# Altium schematic sheet H-Bridge - DRV8829.SchDoc
size A
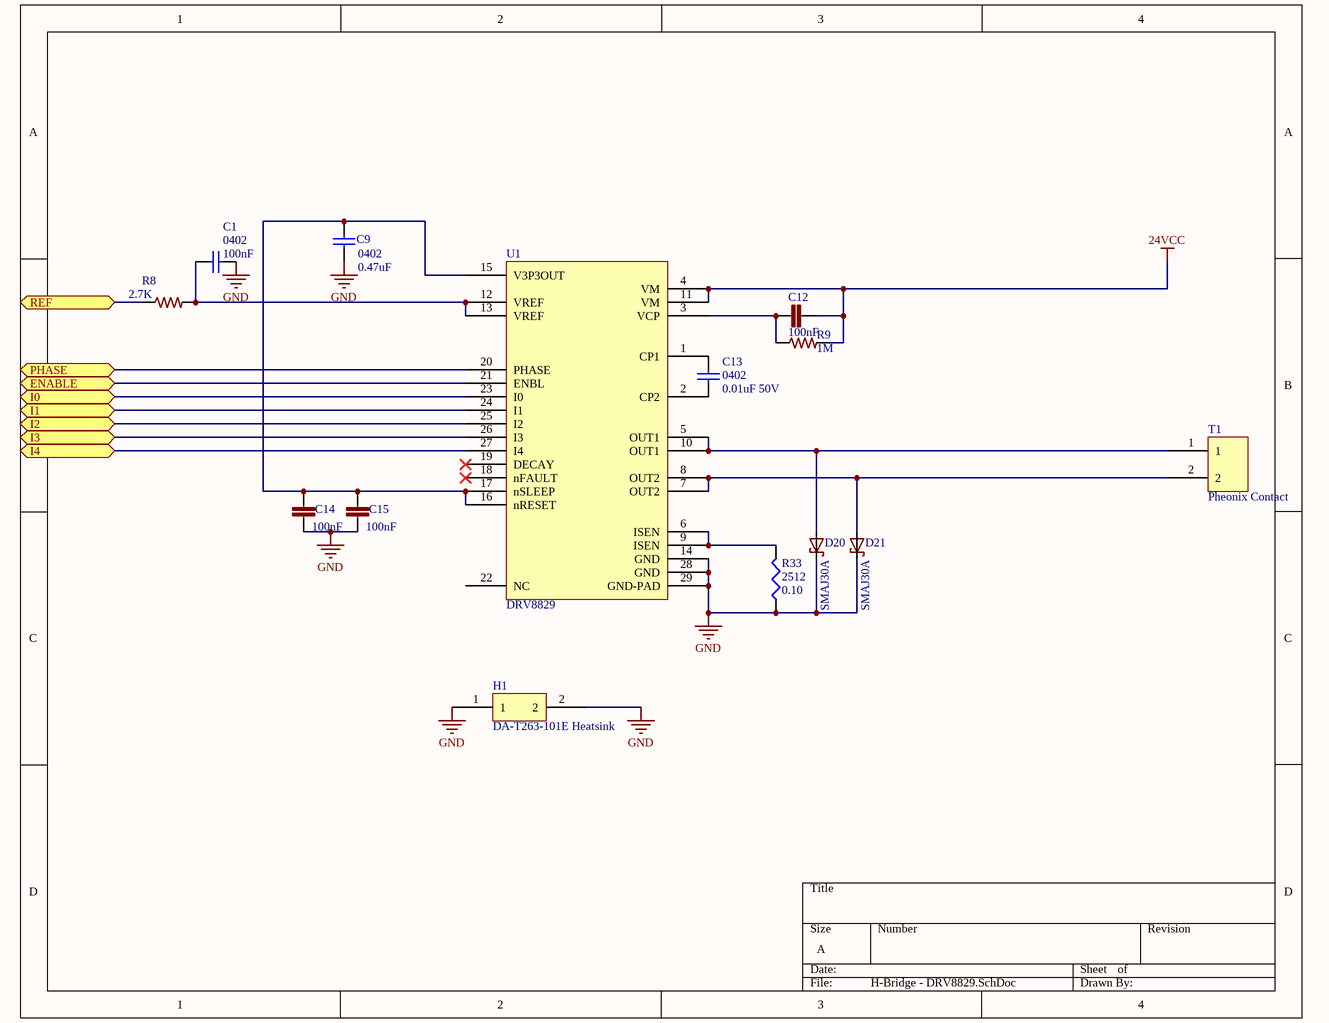
[diagram p0: H-Bridge - DRV8829.SchDoc]

## Parts
C1  value 100nF  [C0402]  (hidden comment: 0402)
C9  value 0.47uF  [C0402]  (hidden comment: 0402)
C12  100nF  [C0603]
C13  value 0.01uF 50V  [C0402]  (hidden comment: 0402)
C14  100nF  [C0402]
C15  100nF  [C0402]
D20  SMAJ30A  [SMA-SM]
D21  SMAJ30A  [SMA-SM]
H1  DA-T263-101E Heatsink  [DA-T263-101E]
R8  2.7K  [R0402]
R9  1M  [R0402]
R33  2512  value 0.10  [2512R-0.55]
T1  Pheonix Contact  [CON-PHEONIX-508-Alt]
U1  DRV8829  [TSSOP28-DRV8829]

## Ports
ENABLE, I0, I1, I2, I3, I4, PHASE, REF

## Nets
24VCC: C12.2 R9.2 U1.4(VM) U1.11(VM)
GND: C1.1 C9.1 C14.2 C15.2 D20.C D21.C H1.1 H1.2 R33.1 U1.14(GND) U1.28(GND) U1.29(GND-PAD)
ENABLE: U1.21(ENBL) ; port ENABLE
I0: U1.23(I0) ; port I0
I1: U1.24(I1) ; port I1
I2: U1.25(I2) ; port I2
I3: U1.26(I3) ; port I3
I4: U1.27(I4) ; port I4
PHASE: U1.20(PHASE) ; port PHASE
REF: R8.1 ; port REF
NetC1_2: C1.2 R8.2 U1.12(VREF) U1.13(VREF)
NetC9_2: C9.2 C14.1 C15.1 U1.15(V3P3OUT) U1.16(nRESET) U1.17(nSLEEP)
NetC12_1: C12.1 R9.1 U1.3(VCP)
NetC13_1: C13.1 U1.2(CP2)
NetC13_2: C13.2 U1.1(CP1)
NetD20_A: D20.A T1.1 U1.5(OUT1) U1.10(OUT1)
NetD21_A: D21.A T1.2 U1.7(OUT2) U1.8(OUT2)
NetR33_2: R33.2 U1.6(ISEN) U1.9(ISEN)

Not connected (* = marked no-connect by the designer): U1 18(nFAULT)* 19(DECAY)* 22(NC)

## Library data of the parts
C1 = 100nF C0402 - GRM155R71C104KA88D: Capacitor (Semiconductor SIM Model); MFR: Murata; Part Description: CAP CER 0.1UF 16V 10% X7R 0402; Tolerance: 10%; Voltage: 16v; Published: 10 - Dec - 2014; LatestRevisionDate: 10 - Dec - 2014; LatestRevisionNote: Ultimachine Footprint Added; Publisher: Ultimachine; Component Type: Chip Capacitor; MFR Part #: GRM155R71C104KA88D; Mounting Type: SMT 0402; Datasheet: http://psearch.murata.com/capacitor/product/GRM155R71C104KA88%23.pdf; Height: 0.5 ±0.05mm; PackageReference: 0402
C9 = GRM155R60J474KE19D: 0.47uF 6.3v C0402 - GRM155R60J474KE19D; MFR: Murata; Part Description: CAP CER 0.47UF 6.3V 10% X5R 0402; Tolerance: 10%; Voltage: 6.3VDC; Published: 10 - Dec - 2014; LatestRevisionDate: 10 - Dec - 2014; LatestRevisionNote: Ultimachine Footprint Added; Publisher: Ultimachine; Component Type: Chip Capacitor; MFR Part #: GRM155R60J474KE19D; Mounting Type: SMT 0402; Datasheet: http://search.murata.co.jp/Ceramy/image/img/A01X/G101/ENG/GRM155R60J474KE19-01.pdf; Height: 0.5 ±0.05mm; PackageReference: 0402
C12 = C0603C104K5RACTU: CAP CER 0603 100nF 50V 10% X7R; LastRevisionNote: ImportComponents; Published: 23-Apr-2014; Publisher: UltiMachine; LastRevisionDate: 23-Apr-2014; ManufacturerPartNumber: C0603C104K5RACTU; VALUE: 100nF
C13 = GRM155R71H103JA88D: CAP CER 10000PF 50V X7R 0402; MFR: Murata; Tolerance: 10%; Voltage: 6.3VDC; Published: 10 - Dec - 2014; LatestRevisionDate: 10 - Dec - 2014; LatestRevisionNote: Ultimachine Footprint Added; Publisher: Ultimachine; Component Type: Chip Capacitor; MFR Part #: GRM155R71H103JA88D; Part Description: CAP CER 10000PF 50V X7R 0402; Mounting Type: SMT 0402; Datasheet: http://search.murata.co.jp/Ceramy/image/img/A01X/G101/ENG/GRM155R71H103JA88-01.pdf; Height: 0.5 ±0.05mm; Digikey #: 490-7763-1-ND; PackageReference: 0402
C14 C15 = GRM155R71C104KA88D: CAP CER 0402 100nF 16V 10% X7R; LastRevisionNote: ImportComponents; Published: 23-Apr-2014; Publisher: UltiMachine; LastRevisionDate: 23-Apr-2014; ManufacturerPartNumber: GRM155R71C104KA88D; VALUE: 100nF
D20 D21 = SMAJ30A: DIODE TVS 30V SMA; LastRevisionNote: ImportComponents; Published: 23-Apr-2014; Publisher: UltiMachine; LastRevisionDate: 23-Apr-2014; ManufacturerPartNumber: SMAJ30A
R8 = ERJ-2RKF2701X: RES SMD 2.7K OHM 1% 1/10W 0402; Manufacturer: Panasonic; ManufacturerPartNumber: ERJ2GEJ105X; LastRevisionNote: ImportComponents; Published: 23-Apr-2014; Publisher: Adam; LastRevisionDate: 23-Apr-2014; VALUE: 2.7K
R9 = ERJ2GEJ105X: RES 0402 1M 100mW 5%; LastRevisionNote: ImportComponents; Published: 23-Apr-2014; Publisher: UltiMachine; LastRevisionDate: 23-Apr-2014; ManufacturerPartNumber: ERJ2GEJ105X; VALUE: 1M
R33 = CSRN2512FTR100: RES SMD 0.1 OHM 1% 2W 2512; MFR: Stackpole ELectronics Inc; PackageReference: 2512; MFR #: CSRN2512FTR100; Digikey #: CSRN2512FTR100TR-ND; PDF: http://www.seielect.com/catalog/SEI-CSR_CSRN.pdf
T1 = Pheonix Contact 2X1
U1 = DRV8829: IC MOTOR DRIVER PAR 28HTSSOP; MFR: Texas Instruments; MFR #: DRV8829PWPR; RHos: Yes; Datasheet: https://www.ti.com/lit/ds/symlink/drv8829.pdf; Digikey #: 296-28829-1-ND